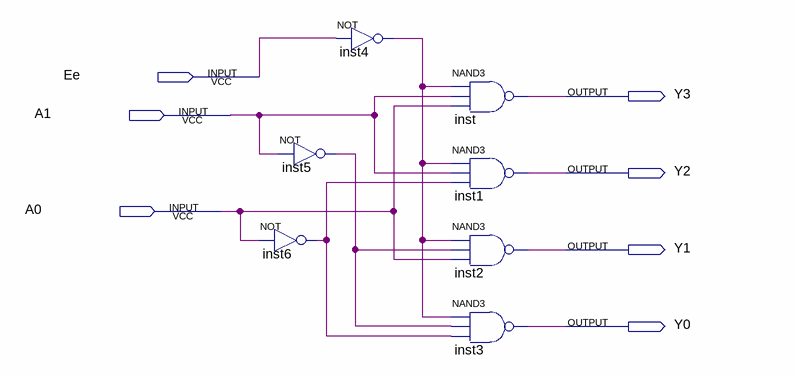
[diagram p0: schematic sheet]
// Quartus schematic design24dec.bdf as structural Verilog: 7 symbols, 7 pins
module design24dec (
  input  Ee,
  input  A1,
  input  A0,
  output Y3,
  output Y2,
  output Y1,
  output Y0
);

  wire inst4_out, inst5_out, inst6_out;

  not inst5 (inst5_out, A1);
  not inst6 (inst6_out, A0);
  not inst4 (inst4_out, Ee);
  nand inst (Y3, inst4_out, A1, A0);
  nand inst1 (Y2, inst4_out, A1, inst6_out);
  nand inst2 (Y1, inst4_out, inst5_out, A0);
  nand inst3 (Y0, inst4_out, inst5_out, inst6_out);
endmodule
